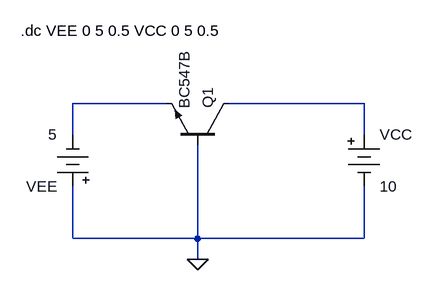
[diagram p0: schematic Ex-3.asc]
Ex-3.asc, the LTspice schematic file:
Version 4
SHEET 1 880 680
WIRE 416 160 272 160
WIRE 720 160 512 160
WIRE 272 208 272 160
WIRE 720 208 720 160
WIRE 272 368 272 288
WIRE 464 368 464 224
WIRE 464 368 272 368
WIRE 720 368 720 288
WIRE 720 368 464 368
WIRE 464 400 464 368
FLAG 464 400 0
SYMBOL npn 512 224 M270
SYMATTR InstName Q1
SYMATTR Value BC547B
SYMBOL Misc\\battery 720 192 R0
WINDOW 123 0 0 Left 0
WINDOW 39 0 0 Left 0
SYMATTR InstName VCC
SYMATTR Value 10
SYMBOL Misc\\battery 272 304 R180
WINDOW 123 0 0 Left 0
WINDOW 39 0 0 Left 0
SYMATTR InstName VEE
SYMATTR Value 5
TEXT 192 48 Left 2 !.dc VEE 0 5 0.5 VCC 0 5 0.5

The netlist it stands for:
* Ex-3.asc
Q1 N002 0 N001 0 BC547B
VCC N002 0 10
VEE 0 N001 5
.model NPN NPN
.model PNP PNP
.lib standard.bjt
.dc VEE 0 5 0.5 VCC 0 5 0.5
.backanno
.end